# Altium schematic sheet Interboard.SchDoc
size A4; SheetNumber: 6; SheetTotal: 7
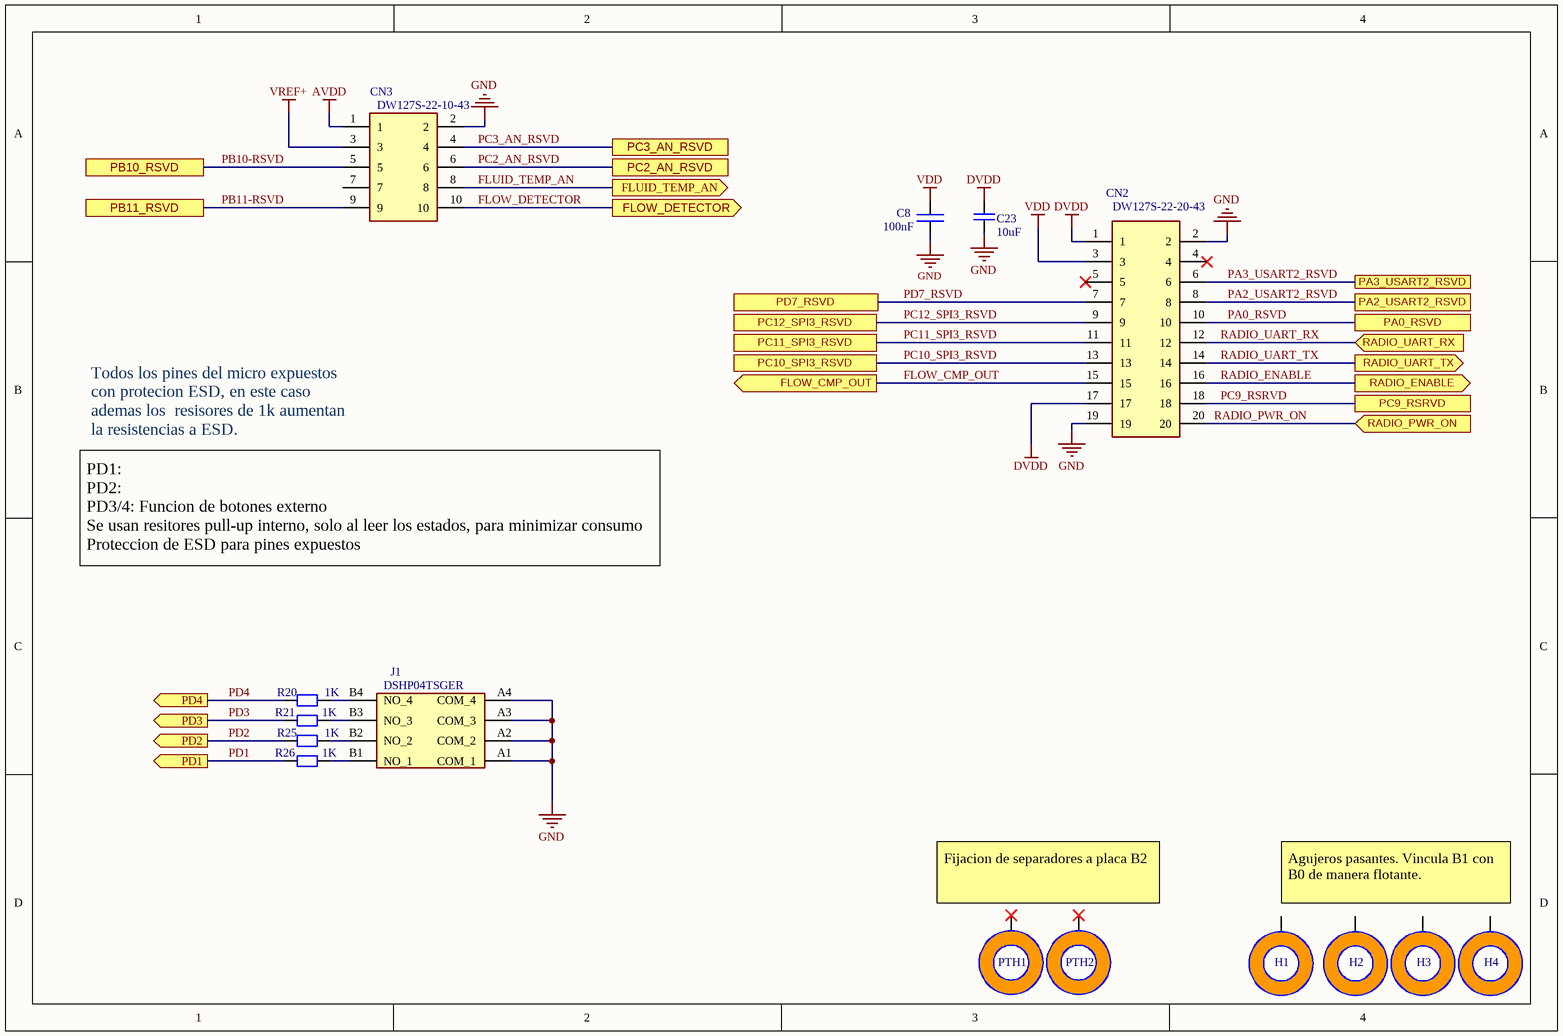
[diagram p0: Interboard.SchDoc]

## Parts
C8  100nF  [CAP_SM0603_YAGEOCC2_N]
C23  10uF  [CAP_SM0603_YAGEOCC2_N]
CN2  DW127S-22-20-43  [DW127S-22-20-43]
CN3  DW127S-22-10-43  [DW127S-22-10-43]
H1  C193465-HOLE  [C193465-HOLE]  (value not drawn)  (no BOM)
H2  C193465-HOLE  [C193465-HOLE]  (value not drawn)  (no BOM)
H3  C193465-HOLE  [C193465-HOLE]  (value not drawn)  (no BOM)
H4  C193465-HOLE  [C193465-HOLE]  (value not drawn)  (no BOM)
J1  DSHP04TSGER  [DSHP04TSGER]
PTH1  PTH-2MM-M  [PTH_M2_M]  (value not drawn)  (no BOM)
PTH2  PTH-2MM-M  [PTH_M2_M]  (value not drawn)  (no BOM)
R20  1K  [RES_SM0603_YAGEORC_N]
R21  1K  [RES_SM0603_YAGEORC_N]
R25  1K  [RES_SM0603_YAGEORC_N]
R26  1K  [RES_SM0603_YAGEORC_N]

## Ports
FLOW_CMP_OUT (out), FLOW_DETECTOR (out), FLUID_TEMP_AN (out), PA0_RSVD, PA2_USART2_RSVD, PA3_USART2_RSVD, PB10_RSVD, PB11_RSVD, PC2_AN_RSVD, PC3_AN_RSVD, PC9_RSRVD, PC10_SPI3_RSVD, PC11_SPI3_RSVD, PC12_SPI3_RSVD, PD1 (out), PD2 (out), PD3 (out), PD4 (out), PD7_RSVD, RADIO_ENABLE (out), RADIO_PWR_ON (in), RADIO_UART_RX (in), RADIO_UART_TX (out)

## Nets
AVDD: CN3.1
DVDD: C23.1 CN2.1 CN2.17
GND: C8.2 C23.2 CN2.2 CN2.19 CN3.2 J1.A1(COM_1) J1.A2(COM_2) J1.A3(COM_3) J1.A4(COM_4)
VDD: C8.1 CN2.3
VREF+: CN3.3
FLOW_CMP_OUT: CN2.15 ; port FLOW_CMP_OUT
FLOW_DETECTOR: CN3.10 ; port FLOW_DETECTOR
FLUID_TEMP_AN: CN3.8 ; port FLUID_TEMP_AN
PA0_RSVD: CN2.10 ; port PA0_RSVD
PA2_USART2_RSVD: CN2.8 ; port PA2_USART2_RSVD
PA3_USART2_RSVD: CN2.6 ; port PA3_USART2_RSVD
PB10-RSVD: CN3.5 ; port PB10_RSVD
PB11-RSVD: CN3.9 ; port PB11_RSVD
PC2_AN_RSVD: CN3.6 ; port PC2_AN_RSVD
PC3_AN_RSVD: CN3.4 ; port PC3_AN_RSVD
PC9_RSRVD: CN2.18 ; port PC9_RSRVD
PC10_SPI3_RSVD: CN2.13 ; port PC10_SPI3_RSVD
PC11_SPI3_RSVD: CN2.11 ; port PC11_SPI3_RSVD
PC12_SPI3_RSVD: CN2.9 ; port PC12_SPI3_RSVD
PD1: R26.2 ; port PD1
PD2: R25.2 ; port PD2
PD3: R21.2 ; port PD3
PD4: R20.2 ; port PD4
PD7_RSVD: CN2.7 ; port PD7_RSVD
RADIO_ENABLE: CN2.16 ; port RADIO_ENABLE
RADIO_PWR_ON: CN2.20 ; port RADIO_PWR_ON
RADIO_UART_RX: CN2.12 ; port RADIO_UART_RX
RADIO_UART_TX: CN2.14 ; port RADIO_UART_TX
NetJ1_B1: J1.B1(NO_1) R26.1
NetJ1_B2: J1.B2(NO_2) R25.1
NetJ1_B3: J1.B3(NO_3) R21.1
NetJ1_B4: J1.B4(NO_4) R20.1

Not connected (* = marked no-connect by the designer): CN2 4* 5*; CN3 7; H1 1; H2 1; H3 1; H4 1; PTH1 1*; PTH2 1*

## Notes on the sheet
- Todos los pines del micro expuestos con protecion ESD, en este caso ademas los  resisores de 1k aumentan la resistencias a ESD.
- PD1:
  PD2:
  PD3/4: Funcion de botones externo
  Se usan resitores pull-up interno, solo al leer los estados, para minimizar consumo
  Proteccion de ESD para pines expuestos
- Fijacion de separadores a placa B2
- Agujeros pasantes. Vincula B1 con B0 de manera flotante.
- Title:
- Size: A4
- Date:
- Sheet:
- Time:
- Of:
- Version:
- Revision:
- Release:
- FLOWMEET SRL
- File

## Library data of the parts
C8 = CC0603KRX7R9BB104: CAP 100nF SM0603 X7R 50V YAGEO CC2; Tolerance (%): 10; Voltage Rating (Volts): 50; Category: Capacitor; Manufacturer: Yageo; Manufacturer Part Number: CC0603KRX7R9BB104; Package: 0603; Value: 100nF; ComponentLink1Description: Manufacturer Website; ComponentLink1URL: http://www.yageo.com; Supplier Part Number 1: 1362556; Supplier 1: Farnell; Supplier 2: Digi-Key; Supplier Part Number 2: 311-1344-1-ND; Datasheet: https://datasheet.lcsc.com/lcsc/2211101700_YAGEO-CC0603KRX7R9BB104_C14663.pdf
C23 = CC0603KRX5R6BB106: CAP 10uF SM0603 X5R 10V YAGEO; Tolerance: 10; Category: Capacitor; Manufacturer: Yageo; Manufacturer Part Number: CC0603KRX5R6BB106; Package: 0603; Value: 10uF; ComponentLink1Description: Manufacturer Website; ComponentLink1URL: http://www.yageo.com
CN2 = DW127S-22-20-43: Header Female SMD 1.27mm 2x10; Manufacturer: Dealon; Vendor: LCSC; Manufacturer_Part_Number: DW127S-22-20-43
CN3 = DW127S-22-10-43: Header Female SMD 1.27mm 2x5; Manufacturer: Dealon; Vendor: LCSC; Manufacturer Part Number: DW127S-22-10-43; Vendor Part Number: *
H1-H4 = C193465-HOLE: Agujero pasante; Category: Mounting Hole; Temperature Max: -; Temperature Min: -
J1 = DSHP04TSGER: DIP Switches / SIP Switches 4pos 0.025A 24VDC 1/2 Pitch; Manufacturer: Kangshen; Vendor Part Number: C3293144; Vendor: LCSC; Manufacturer Part Number: DSHP04TSGER
PTH1 PTH2 = PTH-2MM-M: Montaje rosca 2mm, holgura miniama; Category: Mounting Hole; Temperature Max: -; Temperature Min: -
R20 R21 R25 R26 = RC0603FR-071KL: RES 1K SM0603 YAGEO RC_L; Power (Watts): 0.1; Resistance (Ohms): 1000; Tolerance (%): 1; Category: Resistor; Manufacturer: Yageo; Manufacturer Part Number: RC0603FR-071KL; Package: 0603; Value: 1K; Supplier Part Number 1: 9238484; Supplier 1: Farnell; ComponentLink1URL: http://www.yageo.com; ComponentLink1Description: Manufacturer Website; Supplier 2: Digi-Key; Supplier Part Number 2: 311-1.00KHRCT-ND